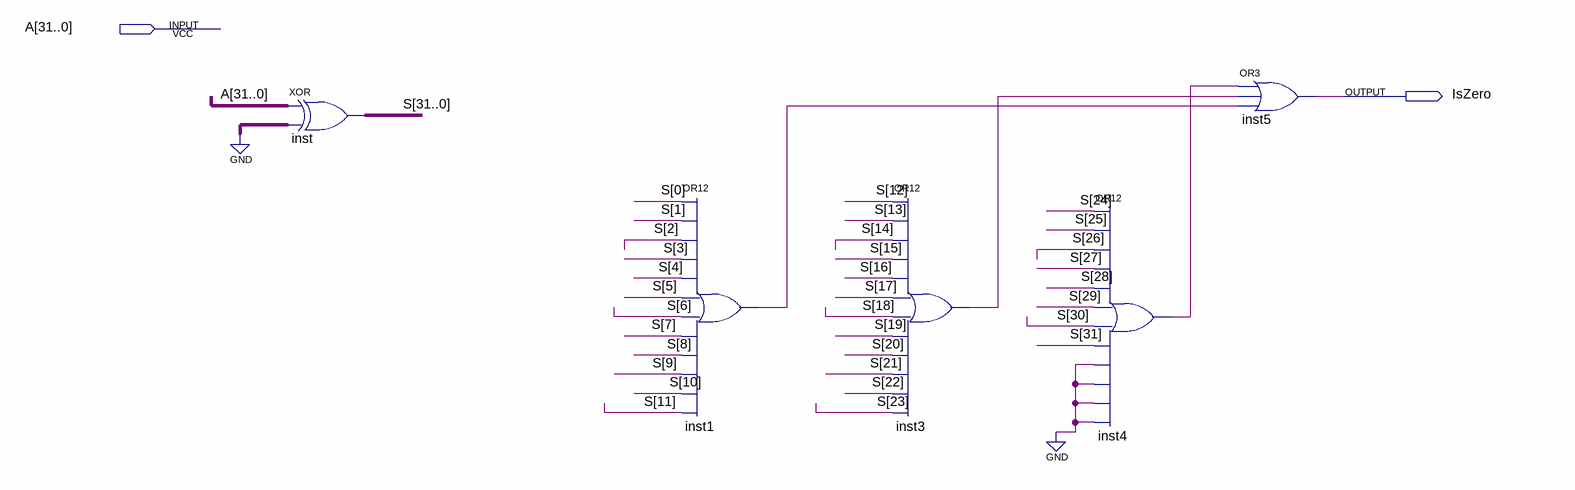
[diagram p0: schematic sheet]
// Quartus schematic IsZero.bdf as structural Verilog: 5 symbols, 2 pins
module IsZero (
  input  [31:0] A,
  output IsZero
);

  wire inst1_out, inst3_out, inst4_out;
  wire [31:0] S;

  assign S = A ^ {32{1'b0}};  // XOR inst, 32 bits wide
  or inst1 (inst1_out, S[0], S[1], S[2], S[3], S[4], S[5], S[6], S[7], S[8], S[9], S[10], S[11]);
  or inst3 (inst3_out, S[12], S[13], S[14], S[15], S[16], S[17], S[18], S[19], S[20], S[21], S[22], S[23]);
  or inst4 (inst4_out, S[24], S[25], S[26], S[27], S[28], S[29], S[30], S[31], 1'b0, 1'b0, 1'b0, 1'b0);
  or inst5 (IsZero, inst4_out, inst3_out, inst1_out);
endmodule
